# Altium project BridgeRectifier.PrjPcb
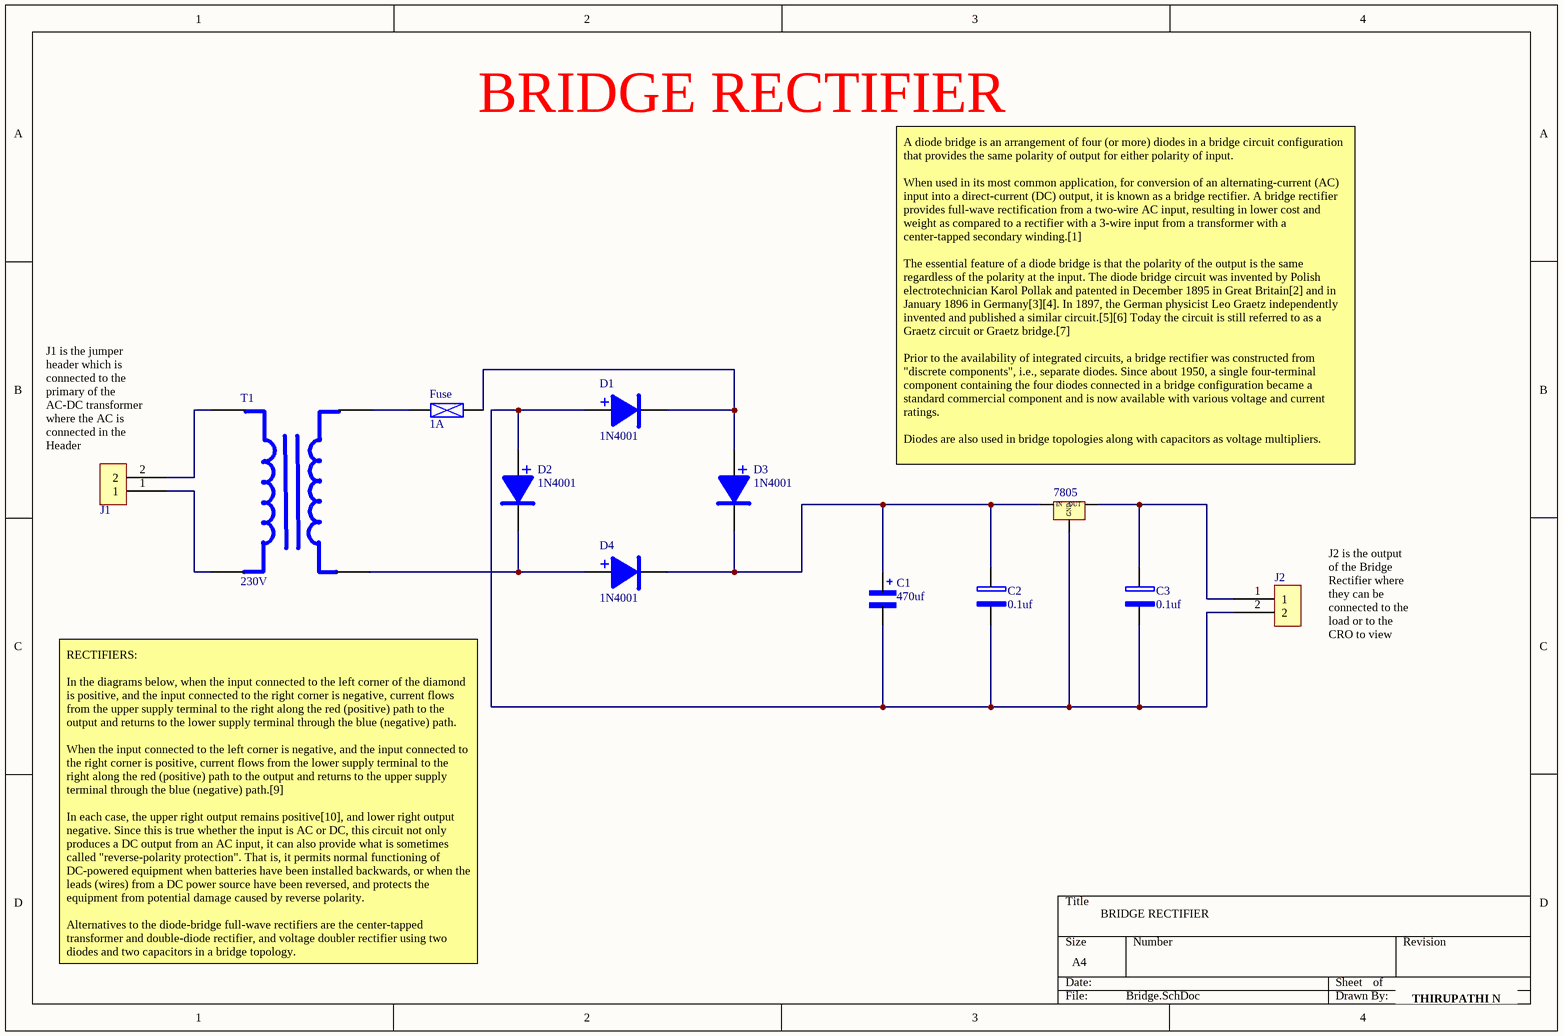
[diagram p0: Bridge.SchDoc]
1 sheet, 12 parts. Net scope: global (net labels, ports and power ports of the same name join across sheets).
Board file: Bridge.PcbDoc

## Sheet Bridge.SchDoc
size A4

### Parts
7805  L78M05CDT-TR  [7805]  (value not drawn)
C1  470uf  [470uf]
C2  0.1uf  [0.1uf]
C3  0.1uf  [0.1uf]
D1  1N4001  [D1N4007]
D2  1N4001  [D1N4007]
D3  1N4001  [D1N4007]
D4  1N4001  [D1N4007]
Fuse  1A  [fuse]
J1  1986717-2  [Headder]  (value not drawn)
J2  1986717-2  [Headder]  (value not drawn)
T1  230V  [230V AC]

### Nets
Net7805_1: 7805.1(IN) C1.1 C2.2 D3.2 D4.2
Net7805_2: 7805.2(GND) C1.2 C2.1 C3.1 D1.1 D2.1 J2.2
Net7805_3: 7805.3(OUT) C3.2 J2.1
NetD1_2: D1.2 D3.1 Fuse.1
NetD2_2: D2.2 D4.1 T1.4
NetFuse_2: Fuse.2 T1.3
NetJ1_1: J1.1 T1.2
NetJ1_2: J1.2 T1.1

### Notes on the sheet
- BRIDGE RECTIFIER
- (near J1) J1 is the jumper header which is connected to the primary of the AC-DC transformer where the AC is connected in the Header
- (near 7805) A diode bridge is an arrangement of four (or more) diodes in a bridge circuit configuration that provides the same polarity of output for either polarity of input.
  When used in its most common application, for conversion of an alternating-current (AC) input into a direct-current (DC) output, it is known as a bridge rectifier. A bridge rectifier provides full-wave rectification from a two-wire AC input, resulting in lower cost and weight as compared to a rectifier with a 3-wire input from a transformer with a center-tapped secondary winding.[1]
  The essential feature of a diode bridge is that the polarity of the output is the same regardless of the polarity at the input. The diode bridge circuit was invented by Polish electrotechnician Karol Pollak and patented in December 1895 in Great Britain[2] and in January 1896 in Germany[3][4]. In 1897, the German physicist Leo Graetz independently invented and published a similar circuit.[5][6] Today the circuit is still referred to as a Graetz circuit or Graetz bridge.[7]
  Prior to the availability of integrated circuits, a bridge rectifier was constructed from "discrete components", i.e., separate diodes. Since about 1950, a single four-terminal component containing the four diodes connected in a bridge configuration became a standard commercial component and is now available with various voltage and current ratings.
  Diodes are also used in bridge topologies along with capacitors as voltage multipliers.
- J2 is the output of the Bridge Rectifier where they can be connected to the load or to the CRO to view the output
- RECTIFIERS:
  In the diagrams below, when the input connected to the left corner of the diamond is positive, and the input connected to the right corner is negative, current flows from the upper supply terminal to the right along the red (positive) path to the output and returns to the lower supply terminal through the blue (negative) path.
  When the input connected to the left corner is negative, and the input connected to the right corner is positive, current flows from the lower supply terminal to the right along the red (positive) path to the output and returns to the upper supply terminal through the blue (negative) path.[9]
  In each case, the upper right output remains positive[10], and lower right output negative. Since this is true whether the input is AC or DC, this circuit not only produces a DC output from an AC input, it can also provide what is sometimes called "reverse-polarity protection". That is, it permits normal functioning of DC-powered equipment when batteries have been installed backwards, or when the leads (wires) from a DC power source have been reversed, and protects the equipment from potential damage caused by reverse polarity.
  Alternatives to the diode-bridge full-wave rectifiers are the center-tapped transformer and double-diode rectifier, and voltage doubler rectifier using two diodes and two capacitors in a bridge topology.
- THIRUPATHI N

### Library data of the parts
7805 = L78M05CDT-TR: STMICROELECTRONICS - L78M05CDT-TR - VOLTAGE REG, FIXED, 5V, 0.5A, TO-252-3; Number of Outputs: 1; Max Input Voltage: 35V; Max Output Current: 500mA; Polarity: Positive; Quiescent Current: 6mA; Min Input Voltage: 7V; Dropout Voltage: 2V; Tolerance: 5%; Power Supply Rejection Ratio (PSRR): 62dB; Supplier 1: Digi-Key; Manufacturer: STMicroelectronics; Manufacturer Part Number: L78M05CDT-TR; RoHS: Yes; Category: Voltage Regulators - Linear; Stock 1: 33280; Pricing 1: 1=0.46000, 10=0.39200, 25=0.36560, 100=0.27170, 250=0.22992, 500=0.21946, 1000=0.16198 (USD); Mount: Surface Mount; Case/Package: TO-252; Number of Pins: 3; Weight: 0.01lb; Contact Plating: Tin,Matte; Min Operating Temperature: 0°C; Max Operating Temperature: 150°C; Output Voltage: 5V; Output Type: Fixed; Packaging: Tape and Reel; Package Quantity: 1; Output Current: 500mA; Nominal Output Voltage: 5V; Number of Regulators: 1; Min Output Voltage: 5V; Max Output Voltage: 5V; Length: 6.6mm; Height: 2.4mm; Width: 6.2mm; Radiation Hardening: No; REACH SVHC: No SVHC; Lead Free: Lead Free; ComponentLink1URL: https://datasheet.ciiva.com/4882/cd00000447-93067-4882369.pdf?src-supplier=Mouser; ComponentLink1Description: https://datasheet.ciiva.com/4882/cd00000447-93067-4882369.pdf?src-supplier=Mouser; ComponentLink2URL: https://datasheet.ciiva.com/15111/getdatasheetpartid-111001-15111751.pdf?src-supplier=Verical; ComponentLink2Description: https://datasheet.ciiva.com/15111/getdatasheetpartid-111001-15111751.pdf?src-supplier=Verical; ComponentLink3URL: https://datasheet.ciiva.com/34303/2021024-34303902.pdf?src-supplier=Jameco; ComponentLink3Description: https://datasheet.ciiva.com/34303/2021024-34303902.pdf?src-supplier=Jameco; ComponentLink4URL: https://datasheet.ciiva.com/16443/cd00000447-16443381.pdf?src-supplier=Future+Electronics; ComponentLink4Description: https://datasheet.ciiva.com/16443/cd00000447-16443381.pdf?src-supplier=Future+Electronics; ComponentLink5URL: https://datasheet.ciiva.com/2041/cd00000447-2041990.pdf?src-supplier=Digi-Key; ComponentLink5Description: https://datasheet.ciiva.com/2041/cd00000447-2041990.pdf?src-supplier=Digi-Key; ComponentLink6URL: https://datasheet.ciiva.com/2041/cd00000447-2041991.pdf?src-supplier=Digi-Key; ComponentLink6Description: https://datasheet.ciiva.com/2041/cd00000447-2041991.pdf?src-supplier=Digi-Key; ComponentLink7URL: https://datasheet.ciiva.com/2041/cd00000447-2041992.pdf?src-supplier=Digi-Key; ComponentLink7Description: https://datasheet.ciiva.com/2041/cd00000447-2041992.pdf?src-supplier=Digi-Key; ComponentLink8URL: https://datasheet.ciiva.com/14111/tbl78mxxc-data-e-14111354.pdf?src-supplier=Distrelec; ComponentLink8Description: https://datasheet.ciiva.com/14111/tbl78mxxc-data-e-14111354.pdf?src-supplier=Distrelec; ComponentLink9URL: https://datasheet.ciiva.com/1512/1834365-1512349.pdf?src-supplier=Element14; ComponentLink9Description: https://datasheet.ciiva.com/1512/1834365-1512349.pdf?src-supplier=Element14; ComponentLink10URL: https://datasheet.ciiva.com/46425/1834365-46425535.pdf?src-supplier=Element14; ComponentLink10Description: https://datasheet.ciiva.com/46425/1834365-46425535.pdf?src-supplier=Element14; ComponentLink11URL: https://datasheet.ciiva.com/41439/001184659-da-01-en-ic-reg-ldo-5v-l78m05cdt-tr-to-252-3-stm-41439772.pdf?src-supplier=Conrad; ComponentLink11Description: https://datasheet.ciiva.com/41439/001184659-da-01-en-ic-reg-ldo-5v-l78m05cdt-tr-to-252-3-stm-41439772.pdf?src-supplier=Conrad; Supplier Part Number 1: 497-1203-1-ND
C1 = 470uf: CAP CER 470UF 4V X5R 1812; Manufacturer: Taiyo Yuden; Manufacturer Part Number: AMK432BJ477MM-T; Tolerance: 20%; Supplier 1: Digi-Key; RoHS: Yes; Category: Ceramic Capacitors; Stock 1: 613; Pricing 1: 1=5.94000, 10=5.79200, 50=5.19760, 100=4.75200 (USD); Mount: Surface Mount; Case/Package: 1812; Case Code (Imperial): 1812; Case Code (Metric): 4532; Min Operating Temperature: -55°C; Max Operating Temperature: 85°C; Packaging: Tape and Reel; Capacitance: 470uF; Voltage Rating: 4V; Length: 0.177inch; Width: 0.126inch; Thickness: 0.106inch; Lead Free: Lead Free; ComponentLink1URL: https://media.digikey.com/pdf/Data%20Sheets/Taiyo%20Yuden%20PDFs%20URL%20links/AMK432BJ477MM_Spec.PDF?src-supplier=Digi-Key; ComponentLink1Description: https://media.digikey.com/pdf/Data%20Sheets/Taiyo%20Yuden%20PDFs%20URL%20links/AMK432BJ477MM_Spec.PDF?src-supplier=Digi-Key; Supplier Part Number 1: 587-4368-1-ND
C2 C3 = CC0402ZRY5V7BB104: Multilayer Ceramic Capacitors MLCC - SMD/SMT 100nF 16V Y5V -20/+80%; Manufacturer: Yageo; Tolerance: 80%; Insulation Resistance: 100GR; Supplier 1: Digi-Key; Manufacturer Part Number: CC0402ZRY5V7BB104; RoHS: Yes; Category: Ceramic Capacitors; Stock 1: 3045044; Pricing 1: 1=0.10000, 10=0.01900, 50=0.01020, 100=0.00830, 500=0.00592, 1000=0.00466, 2500=0.00424, 5000=0.00390 (USD); Mount: Surface Mount; Case/Package: 0402; Case Code (Metric): 1005; Case Code (Imperial): 0402; Min Operating Temperature: -30°C; Max Operating Temperature: 85°C; Dielectric: Y5V; Capacitance: 100nF; Termination: SMD/SMT; Resistor Type: Ceramic; Voltage Rating: 16V; Voltage Rating (DC): 16V; Packaging: Tape and Reel; Package Quantity: 10000; Length: 1mm; Height: 0.5mm; Depth: 0.5mm; Thickness: 0.022inch; Width: 0.02inch; Radiation Hardening: No; Lead Free: Lead Free; Halogen Free: Halogen Free; REACH SVHC: No SVHC; ComponentLink1URL: https://datasheet.ciiva.com/26862/getdatasheetpartid-403483-26862665.pdf?src-supplier=Verical; ComponentLink1Description: https://datasheet.ciiva.com/26862/getdatasheetpartid-403483-26862665.pdf?src-supplier=Verical; ComponentLink2URL: https://datasheet.ciiva.com/143/mlccorderingcode-143947.pdf?src-supplier=Digi-Key; ComponentLink2Description: https://datasheet.ciiva.com/143/mlccorderingcode-143947.pdf?src-supplier=Digi-Key; ComponentLink3URL: https://datasheet.ciiva.com/143/mlccorderingcode-143948.pdf?src-supplier=Digi-Key; ComponentLink3Description: https://datasheet.ciiva.com/143/mlccorderingcode-143948.pdf?src-supplier=Digi-Key; ComponentLink4URL: https://datasheet.ciiva.com/143/mlccorderingcode-143949.pdf?src-supplier=Digi-Key; ComponentLink4Description: https://datasheet.ciiva.com/143/mlccorderingcode-143949.pdf?src-supplier=Digi-Key; ComponentLink5URL: https://datasheet.ciiva.com/11586/upy-gphc-y5v-6-3v-to-50v-5-11586519.pdf?src-supplier=Avnet; ComponentLink5Description: https://datasheet.ciiva.com/11586/upy-gphc-y5v-6-3v-to-50v-5-11586519.pdf?src-supplier=Avnet; ComponentLink6URL: https://datasheet.ciiva.com/28450/1132289-28450424.pdf?src-supplier=Element14; ComponentLink6Description: https://datasheet.ciiva.com/28450/1132289-28450424.pdf?src-supplier=Element14; ComponentLink7URL: https://datasheet.ciiva.com/7978/1132289-7978122.pdf?src-supplier=Element14; ComponentLink7Description: https://datasheet.ciiva.com/7978/1132289-7978122.pdf?src-supplier=Element14; ComponentLink8URL: https://datasheet.ciiva.com/8033/1132289-8033645.pdf?src-supplier=Element14; ComponentLink8Description: https://datasheet.ciiva.com/8033/1132289-8033645.pdf?src-supplier=Element14; ComponentLink9URL: https://datasheet.ciiva.com/8033/1132289-8033647.pdf?src-supplier=Element14; ComponentLink9Description: https://datasheet.ciiva.com/8033/1132289-8033647.pdf?src-supplier=Element14; ComponentLink10URL: https://datasheet.ciiva.com/13386/upy-gphc-y5v-6-3v-to-50v-5-13386335.pdf?src-supplier=Mouser; ComponentLink10Description: https://datasheet.ciiva.com/13386/upy-gphc-y5v-6-3v-to-50v-5-13386335.pdf?src-supplier=Mouser; Supplier Part Number 1: 311-1047-1-ND
D1-D4 = 1N4001: DIODE GEN PURP 50V 1A DO41; Manufacturer: ON Semiconductor / Fairchild; Max Reverse Current: 5uA; Max Surge Current: 30A; Element Configuration: Single; Polarity: Standard; Forward Voltage: 1.1V; Capacitance: 15pF; Power Dissipation: 3W; Supplier 1: Avnet; Manufacturer Part Number: 1N4001; RoHS: Yes; Category: Rectifier Diodes; Pricing 1: 25000=0.01307, 26000=0.01280, 51000=0.01260, 130000=0.01240, 250000=0.01220 (USD); Mount: Through Hole; Number of Pins: 2; Weight: 0.245g; Contact Plating: Tin,Matte; Min Operating Temperature: -55°C; Max Operating Temperature: 175°C; Packaging: Tape and Reel; Package Quantity: 1000; Max Repetitive Reverse Voltage (Vrrm): 50V; Max Forward Surge Current (Ifsm): 30A; Average Rectified Current: 1A; Max Reverse Voltage (DC): 50V; Voltage Rating (DC): 50V; Current Rating: 1A; Output Current: 1A; Peak Non-Repetitive Surge Current: 30A; Reverse Voltage: 50V; Forward Current: 1A; Diameter: 2.72mm; Length: 5.2mm; Height: 5.2mm; Width: 0.25inch; Radiation Hardening: No; Lead Free: Lead Free; REACH SVHC: No SVHC; ComponentLink1URL: https://datasheet.ciiva.com/910/1n4001-910352.pdf?src-supplier=Digi-Key; ComponentLink1Description: https://datasheet.ciiva.com/910/1n4001-910352.pdf?src-supplier=Digi-Key; ComponentLink2URL: https://datasheet.ciiva.com/910/1n4001-910352.pdf?src-supplier=Avnet; ComponentLink2Description: https://datasheet.ciiva.com/910/1n4001-910352.pdf?src-supplier=Avnet; ComponentLink3URL: https://datasheet.ciiva.com/4452/1n4004-81693-4452416.pdf?src-supplier=Mouser; ComponentLink3Description: https://datasheet.ciiva.com/4452/1n4004-81693-4452416.pdf?src-supplier=Mouser; ComponentLink4URL: https://datasheet.ciiva.com/30479/0900766b810c07cd-30479188.pdf?src-supplier=RSComponents; ComponentLink4Description: https://datasheet.ciiva.com/30479/0900766b810c07cd-30479188.pdf?src-supplier=RSComponents; ComponentLink5URL: https://datasheet.ciiva.com/910/1n4001-910353.pdf?src-supplier=Digi-Key; ComponentLink5Description: https://datasheet.ciiva.com/910/1n4001-910353.pdf?src-supplier=Digi-Key; ComponentLink6URL: https://datasheet.ciiva.com/927/1n4001-d-927540.pdf?src-supplier=Digi-Key; ComponentLink6Description: https://datasheet.ciiva.com/927/1n4001-d-927540.pdf?src-supplier=Digi-Key; ComponentLink7URL: https://datasheet.ciiva.com/22685/1504060-22685765.pdf?src-supplier=Element14; ComponentLink7Description: https://datasheet.ciiva.com/22685/1504060-22685765.pdf?src-supplier=Element14; ComponentLink8URL: https://datasheet.ciiva.com/15208/getdatasheetpartid-148723-15208346.pdf?src-supplier=Verical; ComponentLink8Description: https://datasheet.ciiva.com/15208/getdatasheetpartid-148723-15208346.pdf?src-supplier=Verical; ComponentLink9URL: https://datasheet.ciiva.com/8084/1n4007-8084076.pdf?src-supplier=Avnet; ComponentLink9Description: https://datasheet.ciiva.com/8084/1n4007-8084076.pdf?src-supplier=Avnet; ComponentLink10URL: https://datasheet.ciiva.com/22651/1923868-22651932.pdf?src-supplier=Element14; ComponentLink10Description: https://datasheet.ciiva.com/22651/1923868-22651932.pdf?src-supplier=Element14; Supplier Part Number 1: 1N4001
Fuse = 0679L1000-01: FUSE BRD MNT 1A 125VAC/VDC; Manufacturer: Bel; Voltage Rating (AC): 125V; DC Cold Resistance: 90mR; Fuse Type: Board Mount (Cartridge Style Excluded); Approvals: cURus; Supplier 1: Digi-Key; Manufacturer Part Number: 0679L1000-01; RoHS: Yes; Category: Fuses; Stock 1: 434; Pricing 1: 1=0.32000, 5=0.31000, 10=0.29600, 50=0.26400, 100=0.24570, 250=0.21840, 500=0.18200 (USD); Mount: Surface Mount; Case/Package: 2410; Case Code (Imperial): 2410; Case Code (Metric): 6125; Min Operating Temperature: -55°C; Max Operating Temperature: 125°C; Packaging: Tape and Reel; Current Rating: 1A; Voltage Rating (DC): 125V; Length: 0.24inch; Height: 0.11inch; Width: 0.1inch; ComponentLink1URL: http://www.belfuse.com/resources/CircuitProtection/datasheets/0679L%20Sep2016.pdf?src-supplier=Digi-Key; ComponentLink1Description: http://www.belfuse.com/resources/CircuitProtection/datasheets/0679L%20Sep2016.pdf?src-supplier=Digi-Key; ComponentLink2URL: https://www.belfuse.com/resources/CircuitProtection/datasheets/0679L%20Sep2016.pdf?src-supplier=Digi-Key; ComponentLink2Description: https://www.belfuse.com/resources/CircuitProtection/datasheets/0679L%20Sep2016.pdf?src-supplier=Digi-Key; Supplier Part Number 1: 507-1965-1-ND
J1 J2 = 1986717-2: Headers & Wire Housings UNSHRDED STD HDR 3.5MM 2POS; Manufacturer: TE Connectivity; Connector Type: Header; Interlock: No (Without); Screwless Terminal Block: Yes (With); Current Rating: 2A; Number of Positions: 2; Number of Levels: 1; Voltage: 150V; Voltage Rating: 130V; Contact Resistance: 15mR; Plating Thickness: 3um; Pin Length: 0.275inch; Supplier 1: Digi-Key; Manufacturer Part Number: 1986717-2; RoHS: Yes; Category: Headers and Wire Housings; Stock 1: 98; Pricing 1: 1=0.74000, 10=0.46000, 25=0.39360, 50=0.35360, 100=0.34630, 250=0.29476, 500=0.28000, 1000=0.25053, 5000=0.19600 (USD); Mount: Through Hole; Contact Plating: Tin; Color: Green; Contact Material: Copper Alloy; Housing Material: Polyamide; Housing Color: Green; Min Operating Temperature: -40°C; Max Operating Temperature: 110°C; Screw Flange: No (Without); Shrouded: No (Without); Side Stackable: No (Without); Packaging: Bulk; Number of Rows: 1; Max Current Rating: 2A; Package Quantity: 300; Termination: Solder; Number of Positions Per Level: 2; Current: 2A; Number of Contacts: 2; Orientation: Straight; Contact Gender: Male; Number of Poles: 2; Length: 8.58mm; Pitch: 3.5mm; Tail Length: 3.5mm; Depth: 2.8mm; Radiation Hardening: No; ELV: Compliant; REACH SVHC: Unknown; ComponentLink1URL: https://datasheet.ciiva.com/9465/eng-cd-1986717-b1-9465729.pdf?src-supplier=Avnet; ComponentLink1Description: https://datasheet.ciiva.com/9465/eng-cd-1986717-b1-9465729.pdf?src-supplier=Avnet; ComponentLink2URL: https://datasheet.ciiva.com/30492/0900766b81226684-30492513.pdf?src-supplier=RSComponents; ComponentLink2Description: https://datasheet.ciiva.com/30492/0900766b81226684-30492513.pdf?src-supplier=RSComponents; ComponentLink3URL: https://datasheet.ciiva.com/7624/1651060-7624901.pdf?src-supplier=Element14; ComponentLink3Description: https://datasheet.ciiva.com/7624/1651060-7624901.pdf?src-supplier=Element14; ComponentLink4URL: https://datasheet.ciiva.com/36854/eng-ds-5-1773463-2-flush-mount-spring-type-0312-36854555.pdf?src-supplier=Onlinecomponents.com; ComponentLink4Description: https://datasheet.ciiva.com/36854/eng-ds-5-1773463-2-flush-mount-spring-type-0312-36854555.pdf?src-supplier=Onlinecomponents.com; ComponentLink5URL: https://datasheet.ciiva.com/6746/eng-cd-1986717-b2-6746909.pdf?src-supplier=Digi-Key; ComponentLink5Description: https://datasheet.ciiva.com/6746/eng-cd-1986717-b2-6746909.pdf?src-supplier=Digi-Key; Supplier Part Number 1: A104641-ND
T1 = RAC05-12SK/277: AC-DC; Converter; 4.2kV reg; Single Output; 5W; 12V Out; RAC05-K/277 Series; Manufacturer: Recom; Number of Outputs: 1; Max Output Current: 416mA; Efficiency: 83%; Approvals: CE,cURus; Supplier 1: Digi-Key; Manufacturer Part Number: RAC05-12SK/277; RoHS: No; Category: Voltage Regulators - Switching; Stock 1: 71; Pricing 1: 1=10.15000, 5=10.00600, 10=9.86000, 25=9.28000, 50=8.99000, 100=8.70000, 250=8.41000, 500=8.12000 (USD); Mount: Through Hole; Weight: 31.5g; Min Operating Temperature: -40°C; Max Operating Temperature: 85°C; Max Output Voltage: 12V; Voltage - Output 1: 12V; Max Power Dissipation: 5W; Length: 31.7mm; Height: 21.8mm; Width: 26.7mm; ComponentLink1URL: https://www.recom-power.com/pdf/Powerline_AC-DC/RAC05-K_277.pdf?src-supplier=Digi-Key; ComponentLink1Description: https://www.recom-power.com/pdf/Powerline_AC-DC/RAC05-K_277.pdf?src-supplier=Digi-Key; Supplier Part Number 1: 945-3192-ND